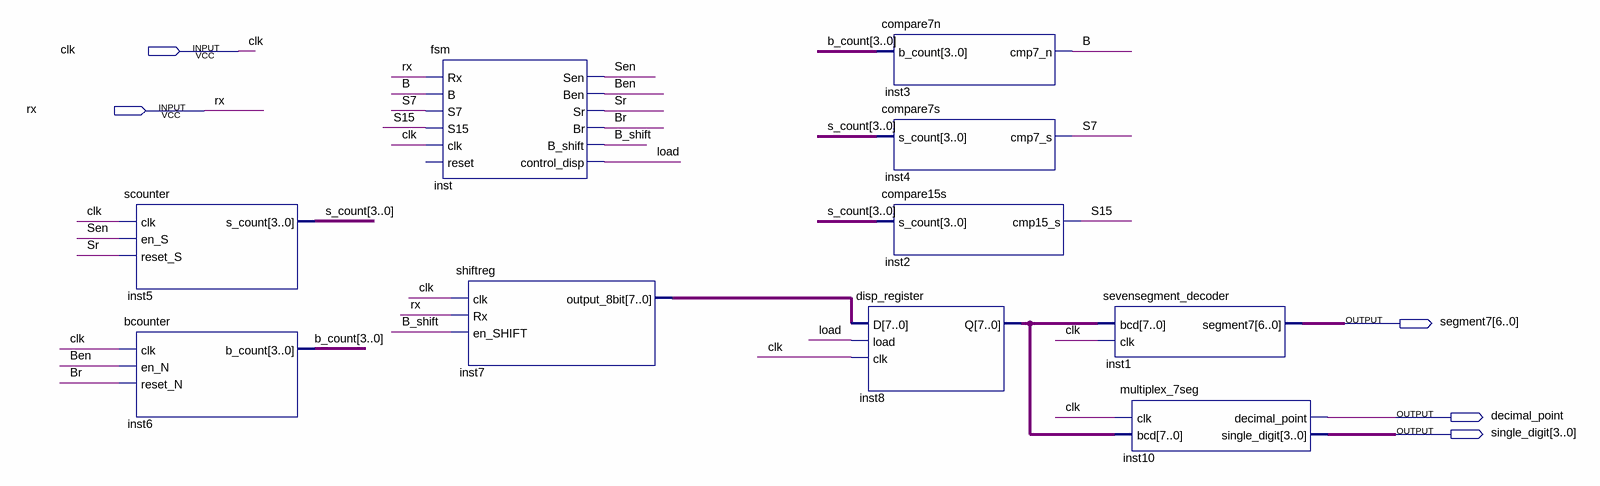
[diagram p0: schematic sheet]
// Quartus schematic lab3vhdl.bdf as structural Verilog: 10 symbols, 5 pins
module lab3vhdl (
  input  clk,
  input  rx,
  output [6:0] segment7,
  output decimal_point,
  output [3:0] single_digit
);

  wire B, B_shift, Ben, Br, load, S7, S15, Sen, Sr;
  wire [3:0] b_count, s_count;
  wire [7:0] inst7_output_8bit, inst8_q;

  scounter inst5 (.clk(clk), .en_S(Sen), .reset_S(Sr), .s_count(s_count));
  bcounter inst6 (.clk(clk), .en_N(Ben), .reset_N(Br), .b_count(b_count));
  fsm inst (
    .Rx(rx), .B(B), .S7(S7), .S15(S15), .clk(clk), .Sen(Sen), .Ben(Ben), .Sr(Sr), .Br(Br), .B_shift(B_shift),
    .control_disp(load));  // open: reset
  shiftreg inst7 (.clk(clk), .Rx(rx), .en_SHIFT(B_shift), .output_8bit(inst7_output_8bit));
  compare7n inst3 (.b_count(b_count), .cmp7_n(B));
  compare7s inst4 (.s_count(s_count), .cmp7_s(S7));
  compare15s inst2 (.s_count(s_count), .cmp15_s(S15));
  disp_register inst8 (.D(inst7_output_8bit), .load(load), .clk(clk), .Q(inst8_q));
  sevensegment_decoder inst1 (.bcd(inst8_q), .clk(clk), .segment7(segment7));
  multiplex_7seg inst10 (.clk(clk), .bcd(inst8_q), .decimal_point(decimal_point), .single_digit(single_digit));
endmodule
